# EAGLE schematic anemometer-r1 (EAGLE 9.4.0)
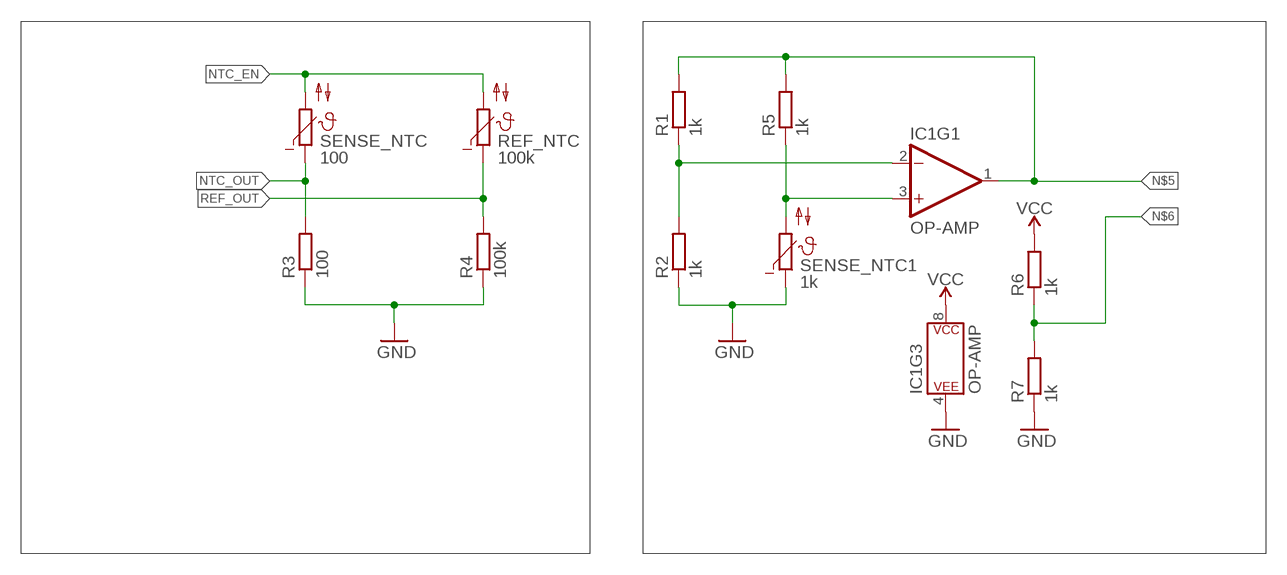
[diagram p0: schematic, sheet 1]

## Parts
IC1  OP-AMP  OPAMP-DUALU  [SO08]
R1  1k  R-EU_R0603  [R0603]
R2  1k  R-EU_R0603  [R0603]
R3  100  R-EU_R0603  [R0603]
R4  100k  R-EU_R0603  [R0603]
R5  1k  R-EU_R0603  [R0603]
R6  1k  R-EU_R0603  [R0603]
R7  1k  R-EU_R0603  [R0603]
REF_NTC  100k  NTC642-6  [P642]
SENSE_NTC  100  NTC642-6  [P642]
SENSE_NTC1  1k  NTC642-6  [P642]

## Nets
GND: IC1.4(P$V-) R2.1 R3.1 R4.1 R7.1 SENSE_NTC1.1
N$1: IC1.2(-IN) R1.1 R2.2
N$2: IC1.3(+IN) R5.1 SENSE_NTC1.2
N$5: IC1.1(OUT) R1.2 R5.2
N$6: R6.1 R7.2
NTC_EN: REF_NTC.2 SENSE_NTC.2
NTC_OUT: R3.2 SENSE_NTC.1
REF_OUT: R4.2 REF_NTC.1
VCC: IC1.8(P$V+) R6.2
Unconnected: IC1.5(+IN) IC1.6(-IN) IC1.7(OUT)

## Library data of the parts
IC1 = SparkFun-IC-Amplifiers:OPAMP-DUAL: Generic op-amp footprint This component is for the standard 358 pinning of a dual op-amp From the LM358 datasheet: Pin 1: Output A Pin 2: Inverting Input A Pin 3: Non-Inverting Input A Pin 4: Gnd Pin 5: Non-Inverting Input B Pin 6: Inverting Input B Pin 7: Output B Pin 8: V+; PROD_ID: NA-XXXXX
R1-R7 = rcl:R-EU_: RESISTOR, European symbol; SPICEPREFIX: R
REF_NTC SENSE_NTC SENSE_NTC1 = ptc-ntc:NTC642-6: PHILIPS NTC; OC_FARNELL: unknown; OC_NEWARK: unknown